# Altium schematic sheet main.SchDoc
size A3
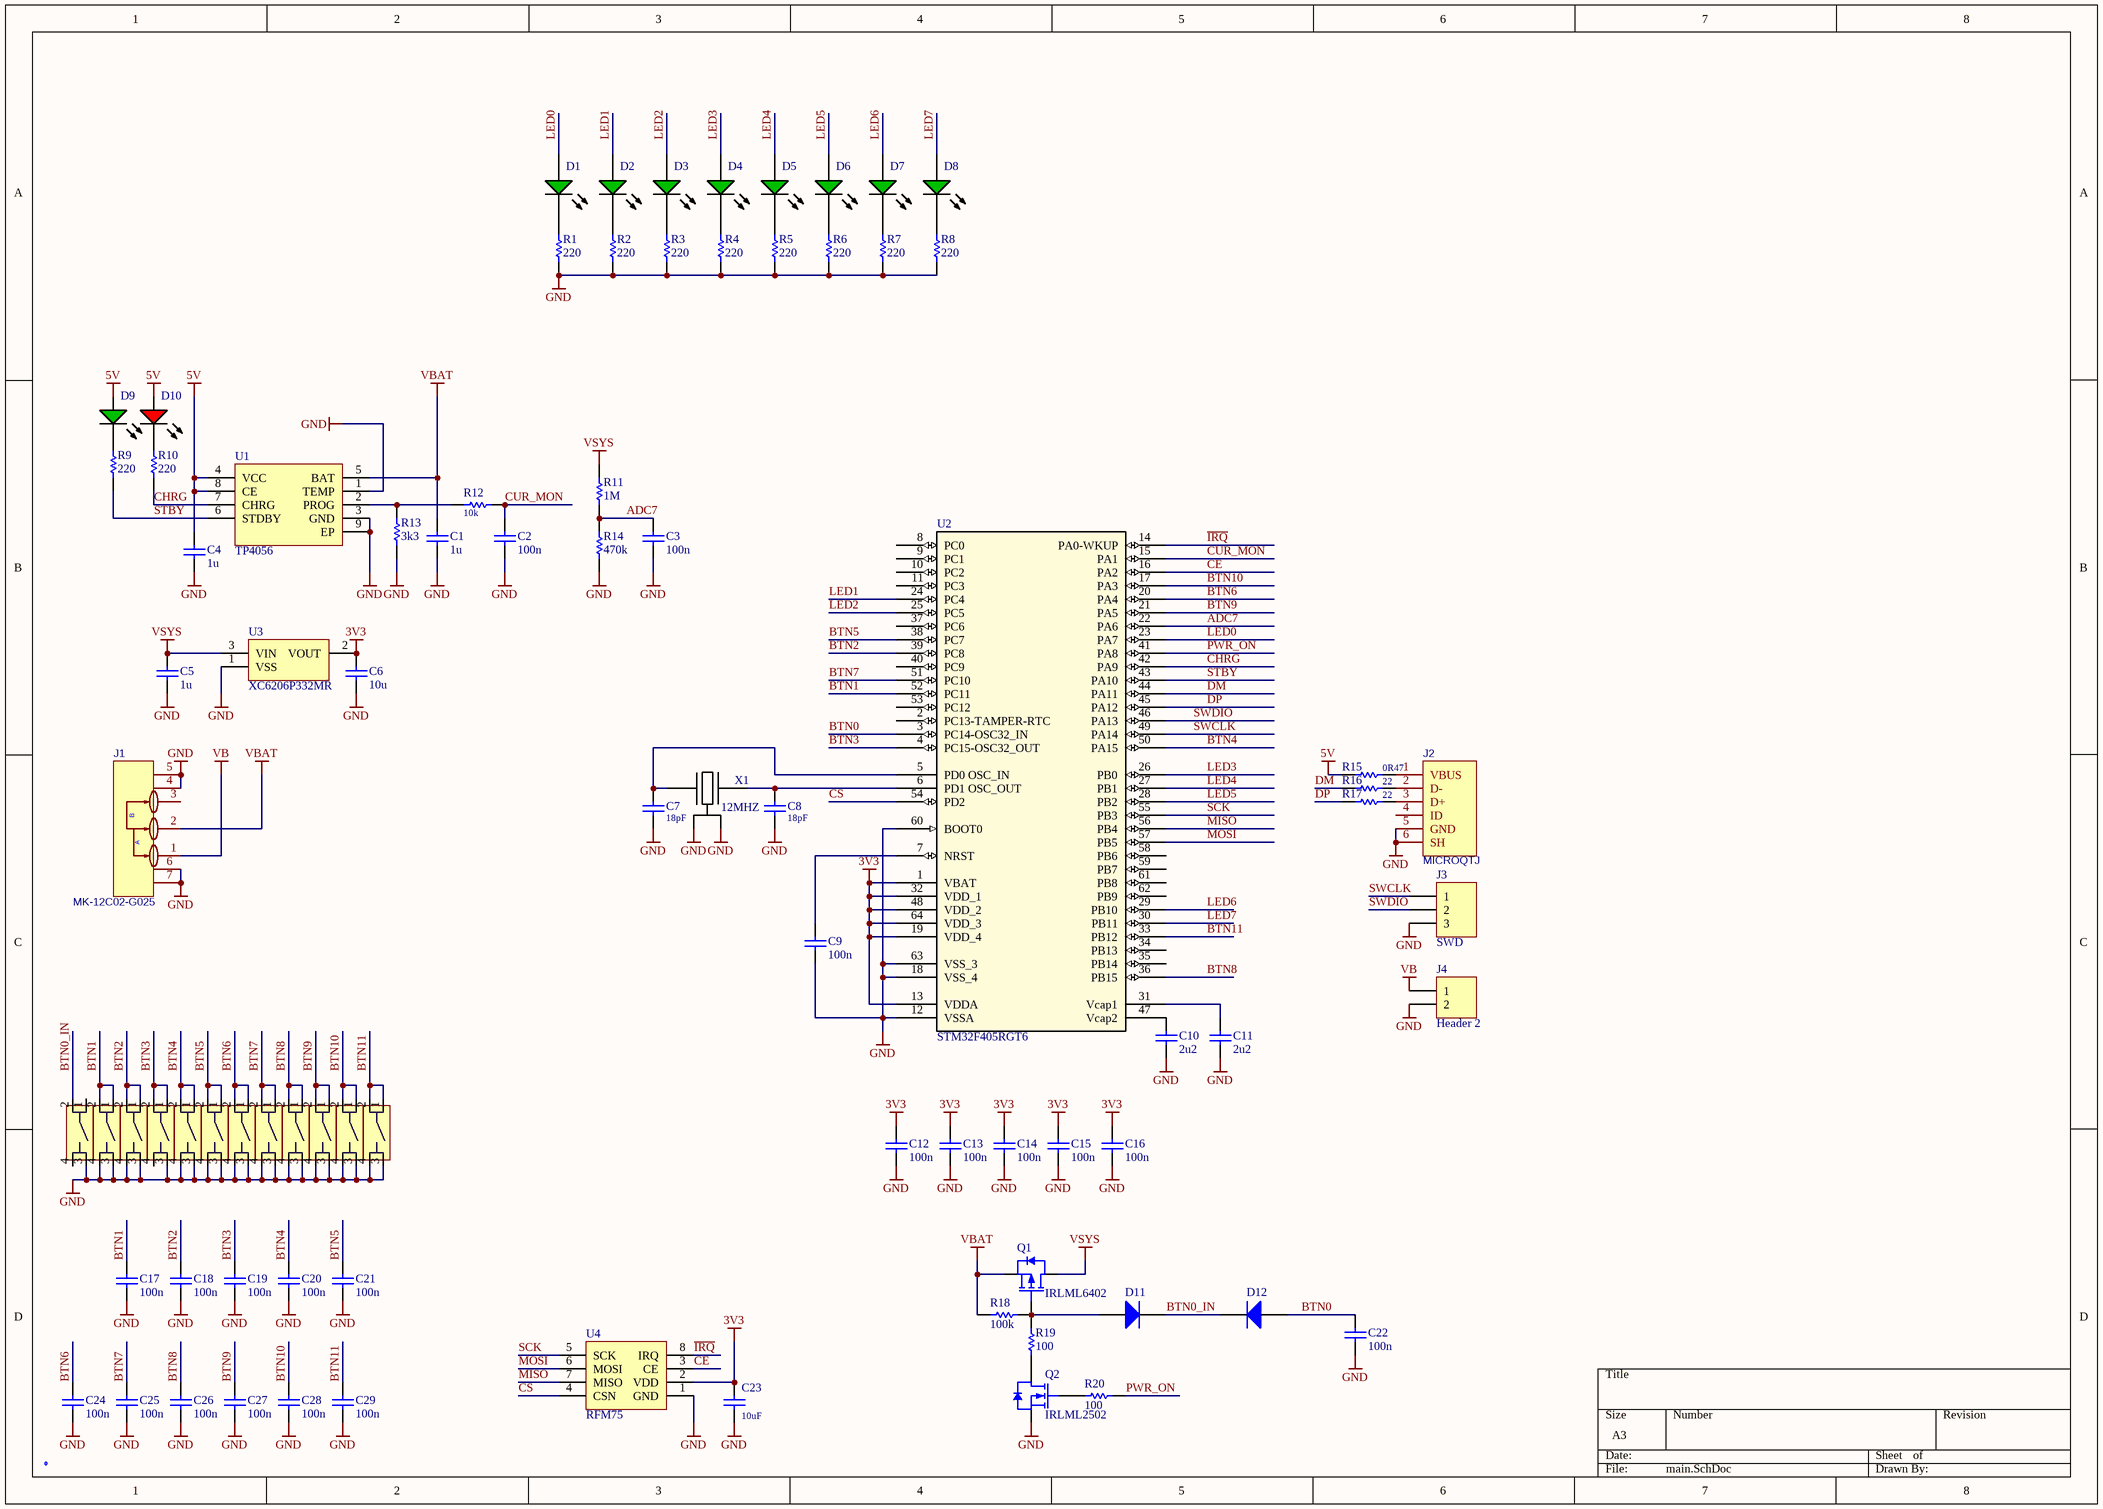
[diagram p0: main.SchDoc]

## Parts
C1  1u  [C1206]
C2  100n  [C0603]
C3  100n  [C0603]
C4  1u  [C1206]
C5  1u  [C1206]
C6  10u  [C1206]
C7  18pF  [C0402]
C8  18pF  [C0402]
C9  100n  [C0402]
C10  2u2  [C0603]
C11  2u2  [C0603]
C12  100n  [C0402]
C13  100n  [C0402]
C14  100n  [C0402]
C15  100n  [C0402]
C16  100n  [C0402]
C17  100n  [C0402]
C18  100n  [C0402]
C19  100n  [C0402]
C20  100n  [C0402]
C21  100n  [C0402]
C22  100n  [C0402]
C23  10uF  [C0805]
C24  100n  [C0402]
C25  100n  [C0402]
C26  100n  [C0402]
C27  100n  [C0402]
C28  100n  [C0402]
C29  100n  [C0402]
D1  GRN  [LED-0603-GRN]  (value not drawn)
D2  GRN  [LED-0603-GRN]  (value not drawn)
D3  GRN  [LED-0603-GRN]  (value not drawn)
D4  GRN  [LED-0603-GRN]  (value not drawn)
D5  GRN  [LED-0603-GRN]  (value not drawn)
D6  GRN  [LED-0603-GRN]  (value not drawn)
D7  GRN  [LED-0603-GRN]  (value not drawn)
D8  GRN  [LED-0603-GRN]  (value not drawn)
D9  GRN  [LED-0603-GRN]  (value not drawn)
D10  RED  [LED-0603-RED]  (value not drawn)
D11  (no value)  [SOD-323]
D12  (no value)  [SOD-323]
J1  MK-12C02-G025  [SW-SMD_MK-12C02-G025]
J2  MICROQTJ  [CONN-USB-MICRO_#1]
J3  SWD  [HDR-1X3_2.54]  (no BOM)
J4  Header 2  [HDR-1X2_2.54]  (no BOM)
LOGO1  LOGO  [LOGO]  (value not drawn)  (no BOM)
Q1  IRLML6402  [SOT-23]
Q2  IRLML2502  [SOT-23]
R1  220  [R0603]
R2  220  [R0603]
R3  220  [R0603]
R4  220  [R0603]
R5  220  [R0603]
R6  220  [R0603]
R7  220  [R0603]
R8  220  [R0603]
R9  220  [R0603]
R10  220  [R0603]
R11  1M  [R0603]
R12  10k  [R0603]
R13  3k3  [R0603]
R14  470k  [R0603]
R15  0R47  [R0603]
R16  22  [R0603]
R17  22  [R0603]
R18  100k  [R0603]
R19  100  [R0603]
R20  100  [R0603]
SW1  PTS810SJS250  [BTN_PTS810]  (value not drawn)
SW2  PTS810SJS250  [BTN_PTS810]  (value not drawn)
SW3  PTS810SJS250  [BTN_PTS810]  (value not drawn)
SW4  PTS810SJS250  [BTN_PTS810]  (value not drawn)
SW5  PTS810SJS250  [BTN_PTS810]  (value not drawn)
SW6  PTS810SJS250  [BTN_PTS810]  (value not drawn)
SW7  PTS810SJS250  [BTN_PTS810]  (value not drawn)
SW8  PTS810SJS250  [BTN_PTS810]  (value not drawn)
SW9  PTS810SJS250  [BTN_PTS810]  (value not drawn)
SW10  PTS810SJS250  [BTN_PTS810]  (value not drawn)
SW11  PTS810SJS250  [BTN_PTS810]  (value not drawn)
SW12  PTS810SJS250  [BTN_PTS810]  (value not drawn)
U1  TP4056  [PowerSOIC-8]
U2  STM32F405RGT6  [LQFP-64]
U3  XC6206P332MR  [SOT-23]
U4  RFM75  [RFM75]
X1  12MHZ  [CRYSTAL_3.2x2.5mm]

## Nets
3V3: C6.2 C12.2 C13.2 C14.2 C15.2 C16.2 C23.2 U2.1(VBAT) U2.13(VDDA) U2.19(VDD_4) U2.32(VDD_1) U2.48(VDD_2) U2.64(VDD_3) U3.2(VOUT) U4.2(VDD)
5V: C4.2 D9.1(A) D10.1(A) R15.2 U1.4(VCC) U1.8(CE)
GND: C1.1 C2.1 C3.1 C4.1 C5.1 C6.1 C7.1 C8.1 C9.1 C10.1 C11.1 C12.1 C13.1 C14.1 C15.1 C16.1 C17.1 C18.1 C19.1 C20.1 C21.1 C22.1 C23.1 C24.1 C25.1 C26.1 C27.1 C28.1 C29.1 J1.4 J1.5 J1.6 J1.7 J2.5(GND) J2.6(SH) J3.3 J4.2 Q2.2(SOURCE) R1.1 R2.1 R3.1 R4.1 R5.1 R6.1 R7.1 R8.1 R13.1 R14.1 SW1.3 SW2.3 SW2.4 SW3.3 SW3.4 SW4.3 SW5.3 SW5.4 SW6.3 SW6.4 SW7.3 SW7.4 SW8.3 SW8.4 SW9.3 SW9.4 SW10.3 SW10.4 SW11.3 SW11.4 SW12.3 SW12.4 U1.1(TEMP) U1.3(GND) U1.9(EP) U2.12(VSSA) U2.18(VSS_4) U2.60(BOOT0) U2.63(VSS_3) U3.1(VSS) U4.1(GND) X1.2(GND) X1.4(GND)
VB: J1.1 J4.1
VBAT: C1.2 J1.2 Q1.2(SOURCE) R18.2 U1.5(BAT)
VSYS: C5.2 Q1.3(DRAIN) R11.2 U3.3(VIN)
ADC7: C3.2 R11.1 R14.2 U2.22(PA6)
BTN0: C22.2 D12.1(A) U2.3(PC14-OSC32_IN)
BTN0_IN: D11.2(K) D12.2(K) SW1.2
BTN1: C17.2 SW2.1 SW2.2 U2.52(PC11)
BTN2: C18.2 SW3.1 SW3.2 U2.39(PC8)
BTN3: C19.2 SW4.1 SW4.2 U2.4(PC15-OSC32_OUT)
BTN4: C20.2 SW5.1 SW5.2 U2.50(PA15)
BTN5: C21.2 SW6.1 SW6.2 U2.38(PC7)
BTN6: C24.2 SW7.1 SW7.2 U2.20(PA4)
BTN7: C25.2 SW8.1 SW8.2 U2.51(PC10)
BTN8: C26.2 SW9.1 SW9.2 U2.36(PB15)
BTN9: C27.2 SW10.1 SW10.2 U2.21(PA5)
BTN10: C28.2 SW11.1 SW11.2 U2.17(PA3)
BTN11: C29.2 SW12.1 SW12.2 U2.33(PB12)
~{CS}: U2.54(PD2) U4.4(CSN)
CE: U2.16(PA2) U4.3(CE)
CHRG: R10.1 U1.7(CHRG) U2.42(PA9)
CUR_MON: C2.2 R12.1 U2.15(PA1)
DM: R16.2 U2.44(PA11)
DP: R17.2 U2.45(PA12)
~{IRQ}: U2.14(PA0-WKUP) U4.8(IRQ)
LED0: D1.1(A) U2.23(PA7)
LED1: D2.1(A) U2.24(PC4)
LED2: D3.1(A) U2.25(PC5)
LED3: D4.1(A) U2.26(PB0)
LED4: D5.1(A) U2.27(PB1)
LED5: D6.1(A) U2.28(PB2)
LED6: D7.1(A) U2.29(PB10)
LED7: D8.1(A) U2.30(PB11)
MISO: U2.56(PB4) U4.7(MISO)
MOSI: U2.57(PB5) U4.6(MOSI)
PWR_ON: R20.1 U2.41(PA8)
SCK: U2.55(PB3) U4.5(SCK)
STBY: R9.1 U1.6(STDBY) U2.43(PA10)
SWCLK: J3.1 U2.49(PA14)
SWDIO: J3.2 U2.46(PA13)
NetC7_2: C7.2 U2.5(PD0_OSC_IN) X1.1(X1)
NetC8_2: C8.2 U2.6(PD1_OSC_OUT) X1.3(X2)
NetC9_2: C9.2 U2.7(NRST)
NetC10_2: C10.2 U2.47(Vcap2)
NetC11_2: C11.2 U2.31(Vcap1)
NetD1_2: D1.2(K) R1.2
NetD2_2: D2.2(K) R2.2
NetD3_2: D3.2(K) R3.2
NetD4_2: D4.2(K) R4.2
NetD5_2: D5.2(K) R5.2
NetD6_2: D6.2(K) R6.2
NetD7_2: D7.2(K) R7.2
NetD8_2: D8.2(K) R8.2
NetD9_2: D9.2(K) R9.2
NetD10_2: D10.2(K) R10.2
NetD11_1: D11.1(A) Q1.1(GATE) R18.1 R19.2
NetJ2_1: J2.1(VBUS) R15.1
NetJ2_2: J2.2(D-) R16.1
NetJ2_3: J2.3(D+) R17.1
NetQ2_1: Q2.1(GATE) R20.2
NetQ2_3: Q2.3(DRAIN) R19.1
NetR12_2: R12.2 R13.2 U1.2(PROG)

Not connected (* = marked no-connect by the designer): J1 3; J2 4(ID); SW1 1 4; SW4 4; U2 2(PC13-TAMPER-RTC) 8(PC0) 9(PC1) 10(PC2) 11(PC3) 34(PB13) 35(PB14) 37(PC6) 40(PC9) 53(PC12) 58(PB6) 59(PB7) 61(PB8) 62(PB9)

## Notes on the sheet
- (in symbol MK-12C02-G025) B; A

## Library data of the parts
C1-C6 C9-C22 C24-C29 = Cap
C7 C8 = CAP: 18pF 0402
C23 = CAP
D1-D9 = LED-0603-GREEN: LED 0603 GRN
D10 = LED-0603-RED: LED 0603 RED
D11 D12 = US1M-13-F
J3 = Header 3
Q1 = 2N7002
Q2 = 2N7002: AOD4184
R1-R11 R13 R14 R18-R20 = Res1
R12 R15-R17 = RES
SW1-SW12 = Component_1
U2 = STM32F405RGT6: MCU STM32F405RGT6
U3 = Component_4_1
X1 = CRYSTAL 12MHZ 3.20mm x 2.50mm: X322512MOB4SI